# EAGLE schematic 2bttn (EAGLE 7.1.0)
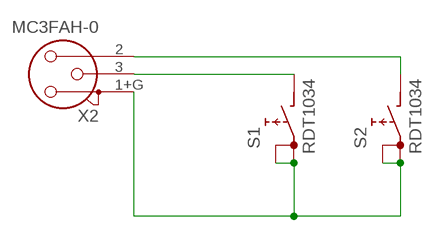
[diagram p0: schematic, sheet 1]

## Parts
S1  RDT1034  [RDT1034]
S2  RDT1034  [RDT1034]
X2  MC3FAH-0  [NC3FAH1-0]

## Nets
N$1: S1.B X2.3
N$2: S1.A S1.A1 S2.A S2.A1 X2.1+G
N$3: S2.B X2.2

## Library data of the parts
S1 S2 = switch:RDT1034: PUSH SWITCH www.radiohm.com
X2 = con-neutrik_ag:MC3?: Neutrik Audio Connector XLR SERIES Stereo 1/4" jack Source: www.neutrik.com/; OC_FARNELL: unknown; OC_NEWARK: unknown